# Altium schematic sheet USB-RS232.SchDoc: Название платы
size 420 x 297 mm; ApprovedBy: Рогов; CheckedBy: Фамилия проверяющего; DrawnBy: Фамилия разработчика; DocumentNumber: Введите номер платы + Э3; SheetNumber: пусто если лист 1, иначе 1; SheetTotal: количество листов; Title1str: (при необходимости вторая строка); DocumentType: тип схемы; Format: A3; ImagePath: Введите номер платы
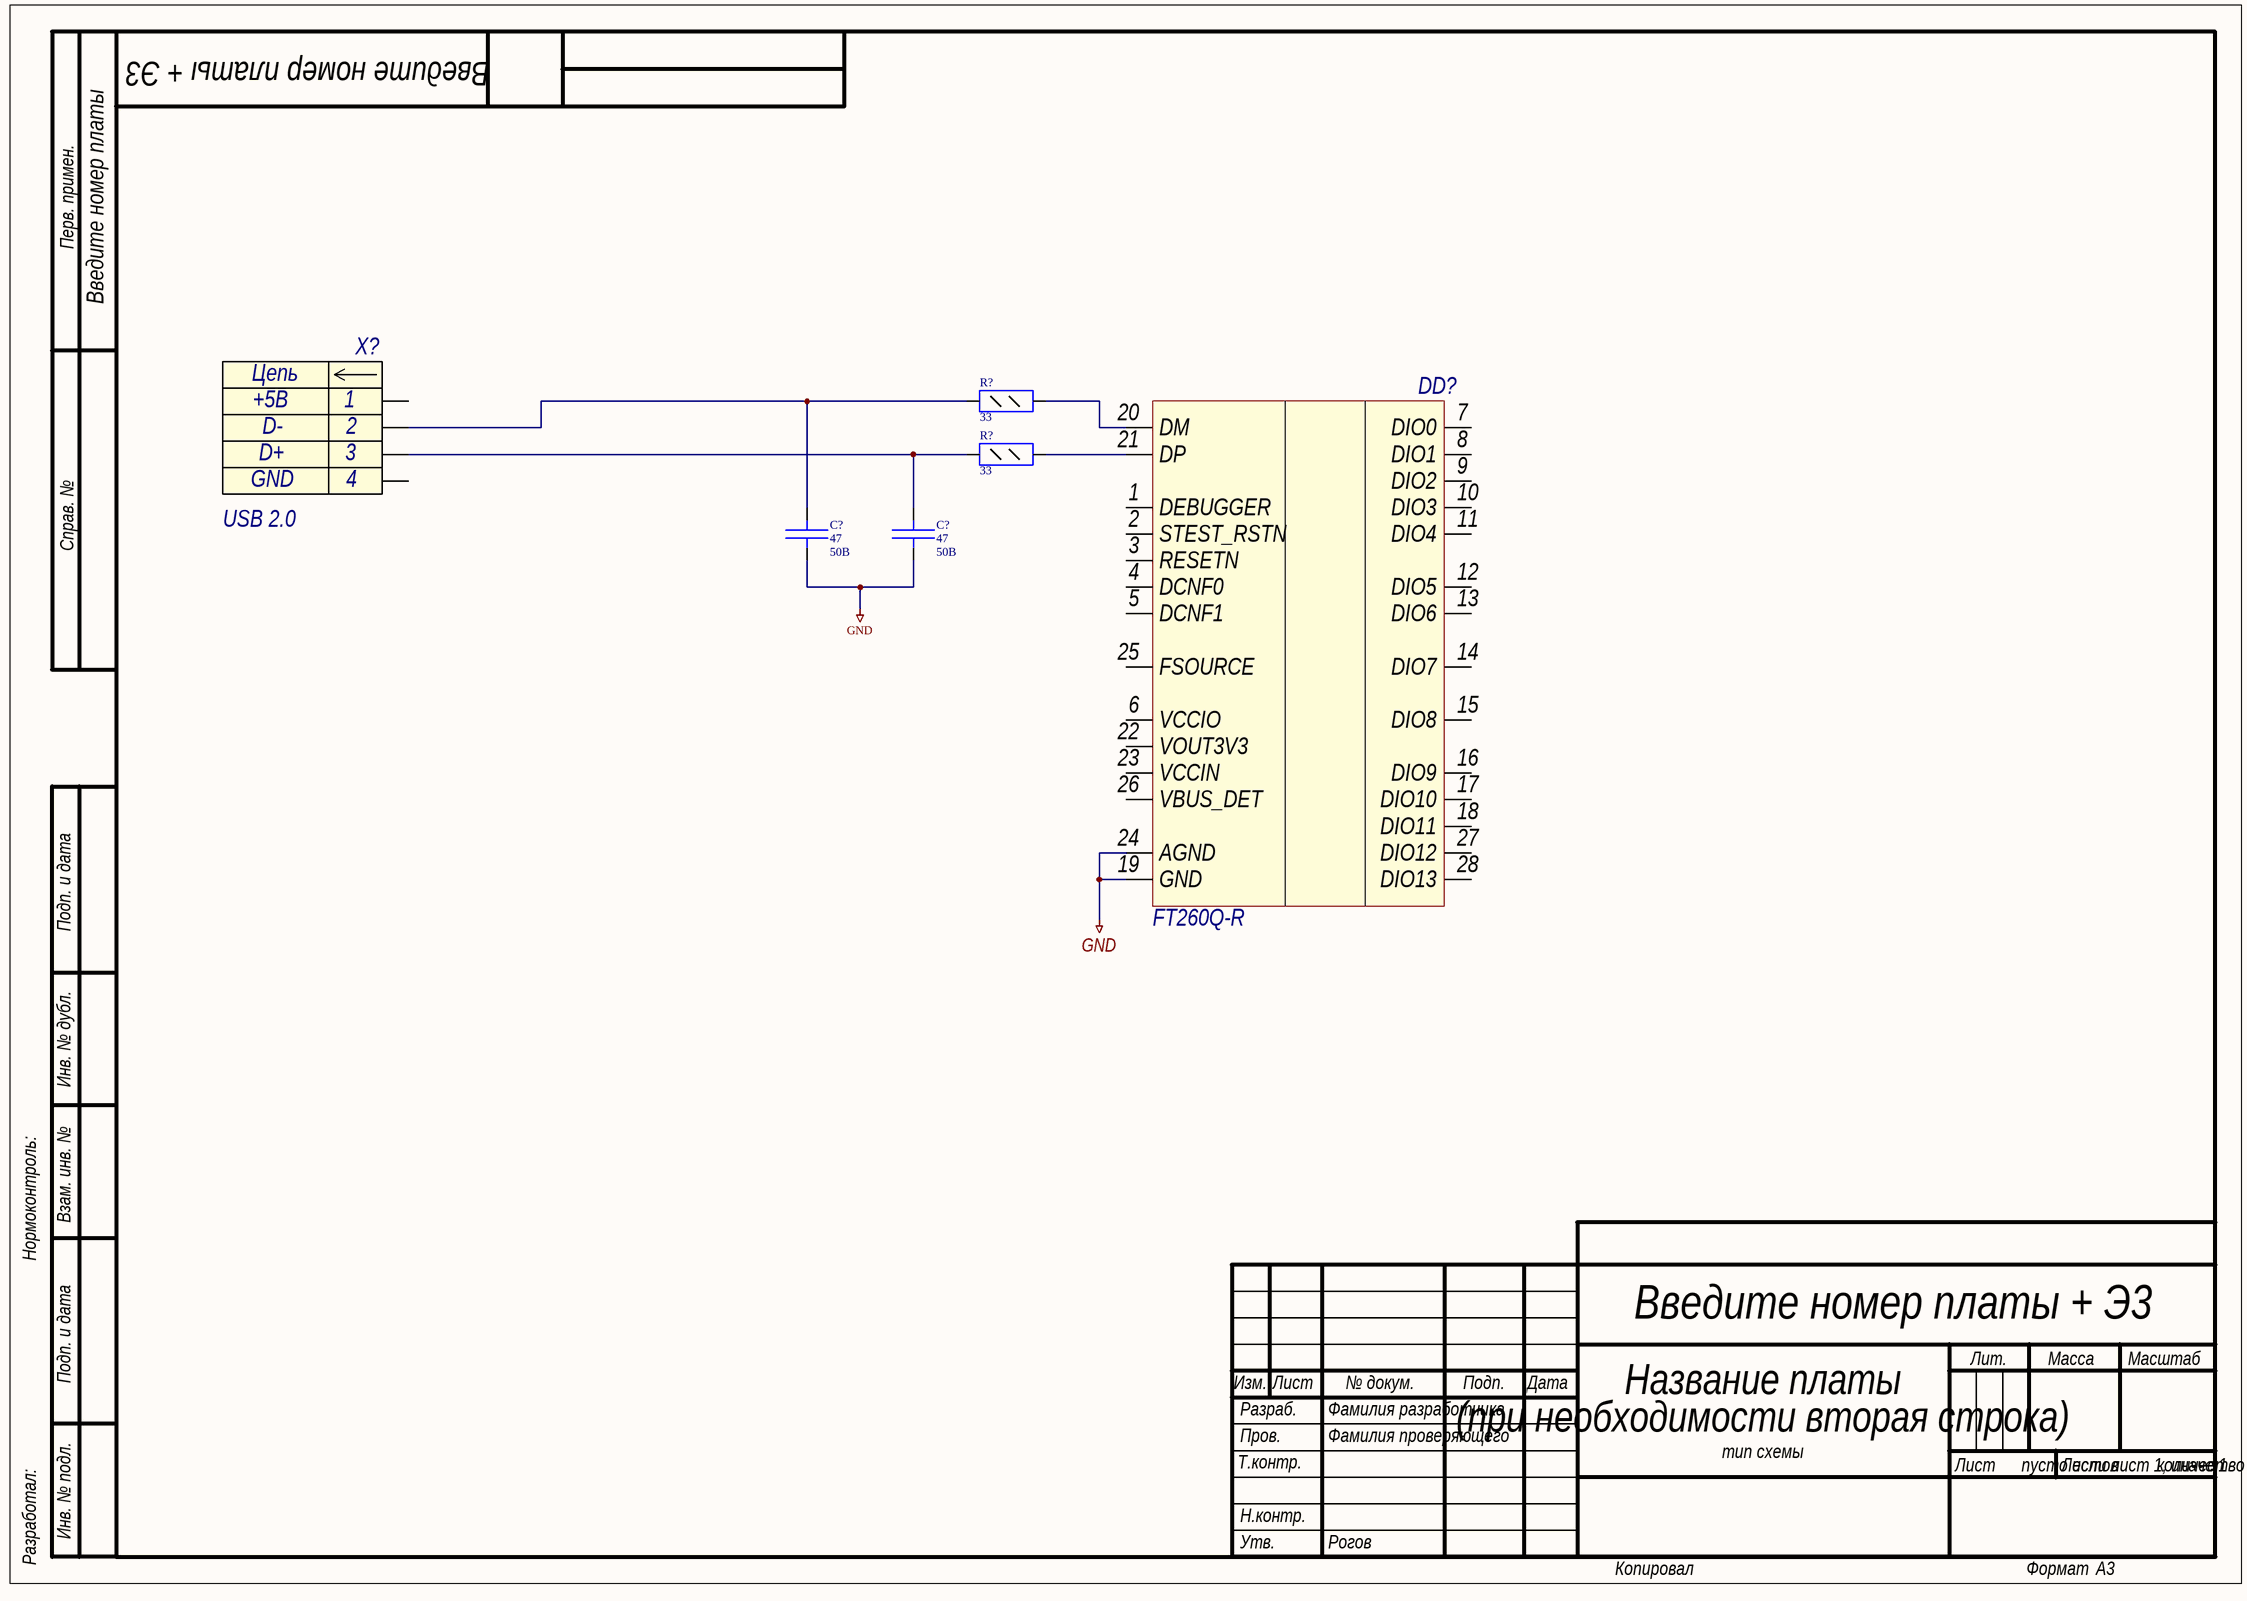
[diagram p0: USB-RS232.SchDoc]

## Parts
(Parts that share a designator on the sheet are numbered #1, #2 ... from top to bottom, then left to right.)
C?#1  value 47  Voltage: 50B  [C0402]  (hidden comment: Capacitor)
C?#2  value 47  Voltage: 50B  [C0402]  (hidden comment: Capacitor)
DD?  FT260Q-R
R?#1  value 33  [R0805]  (hidden comment: Resistor_0,125Вт)
R?#2  value 33  [R0805]  (hidden comment: Resistor_0,125Вт)
X?  USB 2.0  [PLS-4]

## Nets
GND: C?#1.1 C?#2.1 DD?.19(GND) DD?.24(AGND)
NetC?#1_2: C?#1.2 R?#1.1 X?.2
NetC?#2_2: C?#2.2 R?#2.1 X?.3
NetDD?_20: DD?.20(DM) R?#1.2
NetDD?_21: DD?.21(DP) R?#2.2

Not connected (* = marked no-connect by the designer): DD? 1(DEBUGGER) 2(STEST_RSTN) 3(RESETN) 4(DCNF0) 5(DCNF1) 6(VCCIO) 7(DIO0) 8(DIO1) 9(DIO2) 10(DIO3) 11(DIO4) 12(DIO5) 13(DIO6) 14(DIO7) 15(DIO8) 16(DIO9) 17(DIO10) 18(DIO11) 22(VOUT3V3) 23(VCCIN) 25(FSOURCE) 26(VBUS_DET) 27(DIO12) 28(DIO13); X? 1 4

## Notes on the sheet
- Перв. примен.
- Справ. №
- Подп. и дата
- Инв. № дубл.
- Нормоконтроль:
- Взам. инв. №
- Изм.
- Лист
- № докум.
- Подп.
- Дата
- Лит.
- Масса
- Масштаб
- Т.контр.
- Пров.
- Разраб.
- Листов
- Разработал:
- Инв. № подл.
- Н.контр.
- Утв.
- Копировал
- Формат
- (in symbol connect14) Цепь

## Library data of the parts
C?#1 C?#2 = cap14: Конденсатор; Part Name: Capacitors; Part Number: GRM1555C1H470J; id: cap14; TKE: NP0
DD? = FT260Q-R: IC BRIDGE USB TO UART/I2C 28WQFN; Manufacture: FTDI, Future Technology Devices International Ltd; Model: FT260Q-R; Case: 28-WQFN (5x5); HelpURL: https://www.digikey.com/product-detail/en/ftdi-future-technology-devices-international-ltd/FT260Q-R/FT260Q-RTR-ND/5956531
R?#1 R?#2 = res37: Резистор; id: res37; Accuracy: 1%; Part Name: Resistor; Power: 0,125Вт
X? = connect14: Разъем - 4 конт. вилка; Part Number: DS1021-1*4SF112-B; Manufacture: Ningbo connfly electronic; Contact_1: +5В; Contact_2: D-; Contact_3: D+; Contact_4: GND; Etch: 2,54mm; Part Name: PLS-4; id: connect14